# EAGLE design 208_humidity_Si7034 (EAGLE 9.6.2)
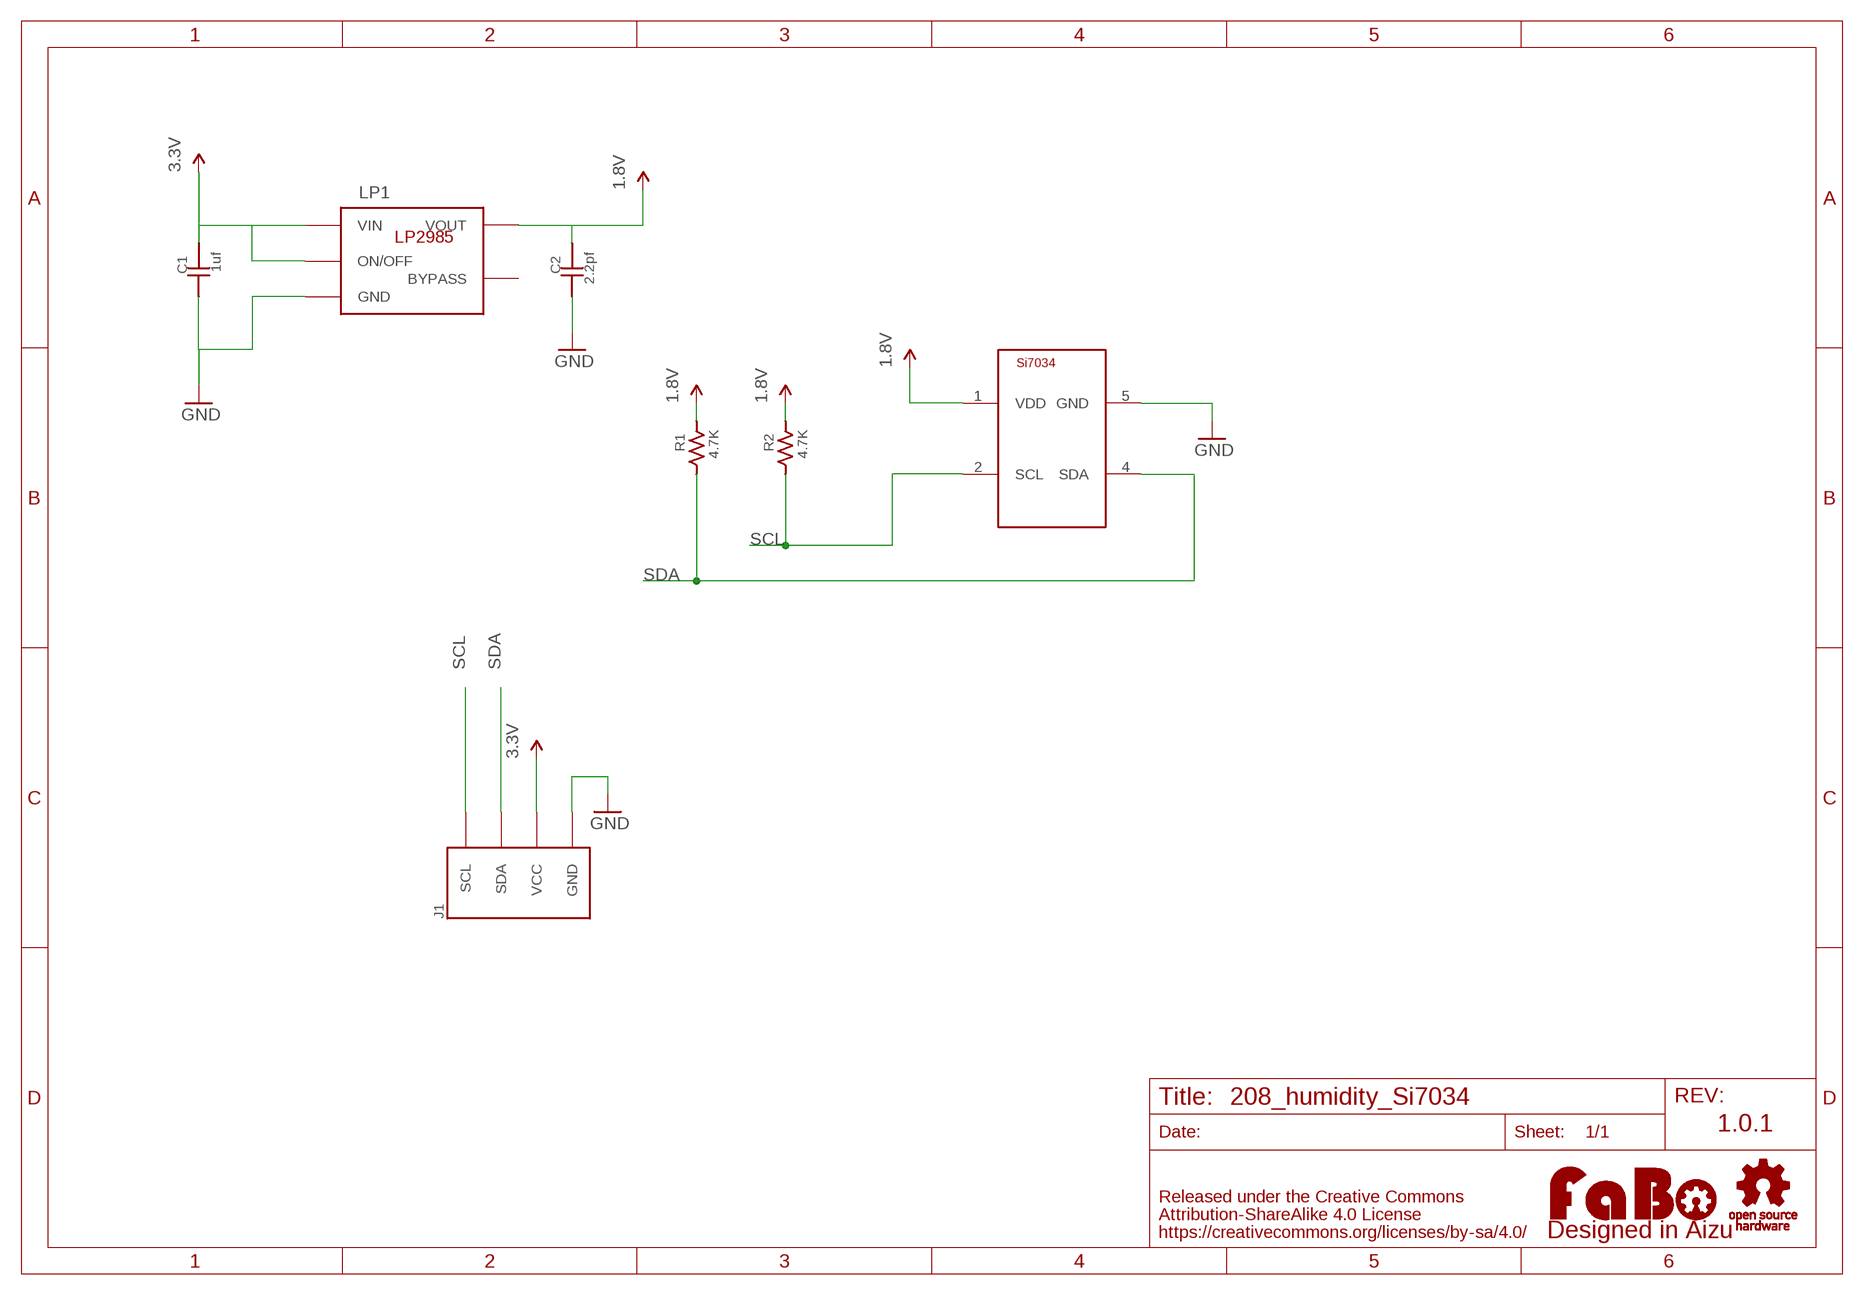
[diagram p0: schematic, sheet 1]

## Parts
C1  1uf  CAPACITOR0603  [0603]
C2  2.2pf  CAPACITOR0603  [0603]
J1  BRICK_I2C  [BRICK_I2C]
LOGO1  LOGO_FABO-M  [LOGO_FABO_M]
LP1  TI-LP2985-18DBVT  [TI-LP2985]
R1  4.7K  RESISTOR-0603  [0603]
R2  4.7K  RESISTOR-0603  [0603]
U$2  LOGO_OSHW-M_BOTTOM  [LOGO_OSHW_M_BOTTOM]
U$3  SILICONLABS-SI7034  [SILICONLABS-SI7034]

## Nets
1.8V: C2.2 LP1.5(VOUT) R1.2 R2.2 U$3.1(VDD)
3.3V: C1.2 J1.VCC LP1.1(VIN) LP1.3(ON/OFF)
GND: C1.1 C2.1 J1.GND LP1.2(GND) U$3.5(GND)
SCL: J1.SCL R2.1 U$3.2(SCL)
SDA: J1.SDA R1.1 U$3.4(SDA)
Unconnected: LP1.4(BYPASS)

## Notes on the sheet
- 1.0.1

## Library data of the parts
C1 C2 = FaBo-Capacitor:CAPACITOR: CAPACITOR
J1 = gclue:BRICK_I2C: FaBo Brick 4pin(I2C)
LOGO1 = component:LOGO_FABO
LP1 = FaBo-Supply:TI-LP2985: LP2985
R1 R2 = FaBo-Resistors:RESISTOR: RESISTOR
U$2 = component:LOGO_OSHW
U$3 = FaBo-Mems:SILICONLABS-SI7034

## Board
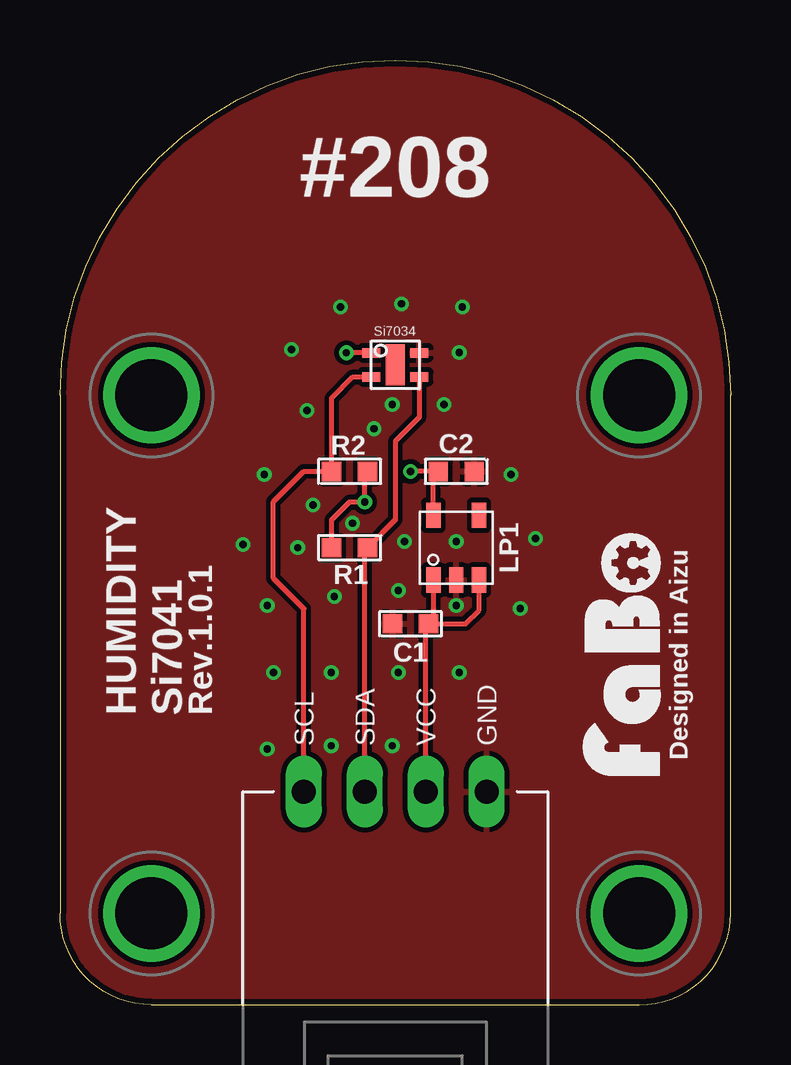
[diagram p1: board, top side]
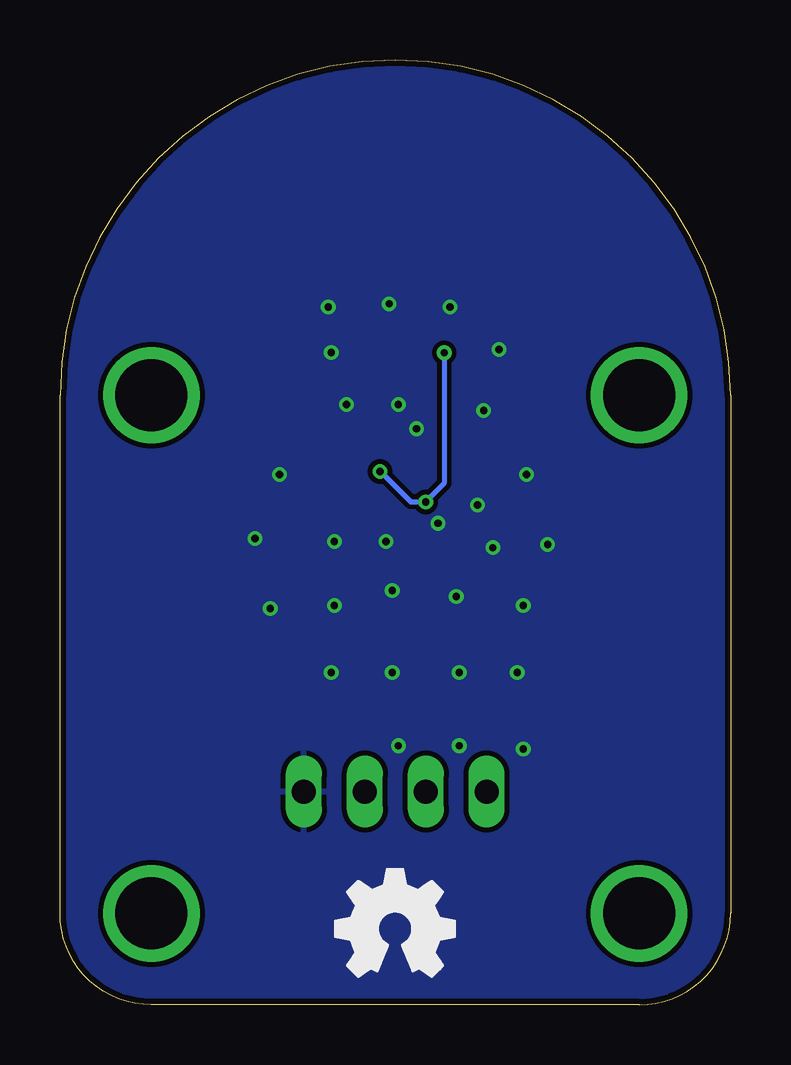
[diagram p2: board, bottom side, seen from below]

Size 27.94 x 39.37 mm. Coordinates in mm from the lower left corner, seen from the top.
Copper layers (1*16): Top 0.035mm / dielectric 1.6mm / Bottom 0.035mm
Design rules "PCBway": minimum track width 6mil, minimum drill 12mil, track to track 6mil, track to pad 6mil, pad to pad 6mil, via to via 6mil, smd to smd 6mil, copper to edge 10mil, drill to drill 10mil, minimum pad ring 10mil, minimum via ring 6mil, stop-mask expansion 2mil, vias tented up to drill 100mil, thermal gap 8mil

### Footprints (pad centres in the part's own frame; a part is rotated, then mirrored left to right if it is on the bottom)
0603 = smd 0.8 x 0.8: 1 -0.75,0; 2 0.75,0
BRICK_I2C = drill 1 long: GND 3.81,-10.16; SCL -3.81,-10.16; SDA -1.27,-10.16; VCC 1.27,-10.16 | drill 3 pad 3.81: P$1 -10.16,6.35; P$2 10.16,6.35; P$3 -10.16,-15.24; P$4 10.16,-15.24
TI-LP2985 = smd 0.6 x 1.05: 1 -0.95,-1.35; 2 0,-1.35; 3 0.95,-1.35; 4 0.95,1.35; 5 -0.95,1.35
SILICONLABS-SI7034 = smd 0.75 x 0.4: 1 -1,0.5; 2 -1,-0.5; 4 1,-0.5; 5 1,0.5 | smd 0.8 x 1.7: 36 0,0

### Placement (x,y rotation side)
C1  14.61,15.88 0 top
C2  16.51,22.23 180 top
J1  13.97,19.05 0 top
LOGO1  25.4,14.61 90 top
LP1  16.51,19.05 0 top
R1  12.06,19.05 180 top
R2  12.06,22.23 0 top
U$2  13.97,3.17 0 top
U$3  13.97,26.67 0 top

### Tracks (layer width: path | path; a pad name or v marks a point on that pad's centre or on a via)
1.8V  (via drill 0.3)
  Top 0.203: LP1.5 15.56,22.02 C2.2 v14.61,22.23 | R2.2 12.7,22.11 v12.7,20.95 12.06,20.95 11.31,20.2 R1.2 | U$3.1 v11.93,27.17
  Bottom 0.203: v14.61,22.23 13.34,20.95 v12.7,20.95 11.93,21.73 v11.93,27.17
3.3V
  Top 0.203: J1.VCC 15.24,15.76 C1.2 | LP1.3 17.46,16.44 16.89,15.88 C1.2 | LP1.1 15.56,16.07 C1.2
GND  (via drill 0.3)
  other vias: 16.51,16.64 16.51,19.3 14.35,19.3 10.54,20.83 12.19,20.07 9.91,19.05 11.43,17.02 14.1,17.27 11.3,13.84 14.1,13.84 16.64,13.84 8.89,13.84 19.18,16.51 8.64,16.64 7.62,19.18 8.51,22.1 19.81,19.43 18.8,22.1 13.08,24 16,25.02 13.84,25.02 10.29,24.77 14.22,29.21 16.64,27.18 16.76,29.08 11.68,29.08 9.65,27.3 13.84,10.79 11.3,10.79 8.64,10.67
  pour Bottom (isolate 0.203): 0,0 27.94,0 27.94,39.37 0,39.37
  pour Top (isolate 0.203): 0,0 27.94,0 27.94,39.37 0,39.37
SCL
  Top 0.203: J1.SCL 10.16,16.51 8.89,17.78 8.89,20.95 10.16,22.23 R2.1 11.31,25.29 12.2,26.17 U$3.2
SDA
  Top 0.203: J1.SDA 12.7,18.93 R1.1 13.97,20.2 13.97,23.5 14.97,24.5 U$3.4

### Text on the board
tPlace: #208 | Designed in Aizu | HUMIDITY / Si7041 | Rev.1.0.1